# Altium schematic sheet ShiftRegister.SchDoc
size A4
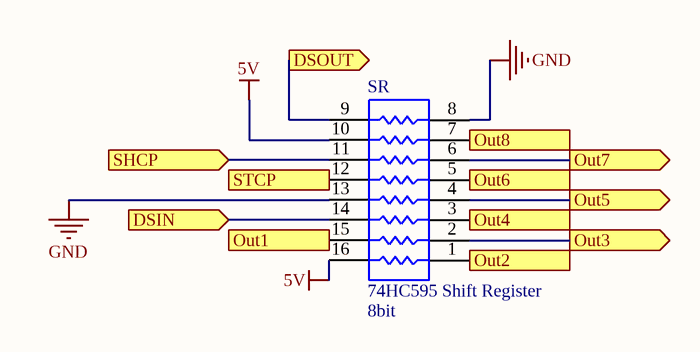
[diagram p0: ShiftRegister.SchDoc]

## Parts
SR  74HC595 Shift Register  value 8bit  [SO-16_L]

## Ports
DSIN (in), DSOUT (out), Out1 (out), Out2 (out), Out3 (out), Out4 (out), Out5 (out), Out6 (out), Out7 (out), Out8 (out), SHCP (in), STCP (in)

## Nets
5V: SR.10 SR.16
GND: SR.8 SR.13
DSIN: SR.14 ; port DSIN
DSOUT: SR.9 ; port DSOUT
Out1: SR.15 ; port Out1
Out2: SR.1 ; port Out2
Out3: SR.2 ; port Out3
Out4: SR.3 ; port Out4
Out5: SR.4 ; port Out5
Out6: SR.5 ; port Out6
Out7: SR.6 ; port Out7
Out8: SR.7 ; port Out8
SHCP: SR.11 ; port SHCP
STCP: SR.12 ; port STCP

## Notes on the sheet
- Title
- Size:
- Date:
- A4
- Number:
- Time:
- Revision:
- Sheet
- of
- File:

## Library data of the parts
SR = Res Pack3: Isolated Resistor Network; Published: 24-Mar-1999; LatestRevisionDate: 29-May-2009; LatestRevisionNote: IPC-7351 Footprint Added.; PackageReference: SO-16; Publisher: Altium Limited; PackageDescription: 16-Pin Small Outline Integrated Circuit 1.27 mm Pitch; Code_JEDEC: MS-012-AC; Code_IPC: SOIC127P600-16